# EAGLE schematic uoolight (EAGLE 6.5.0)
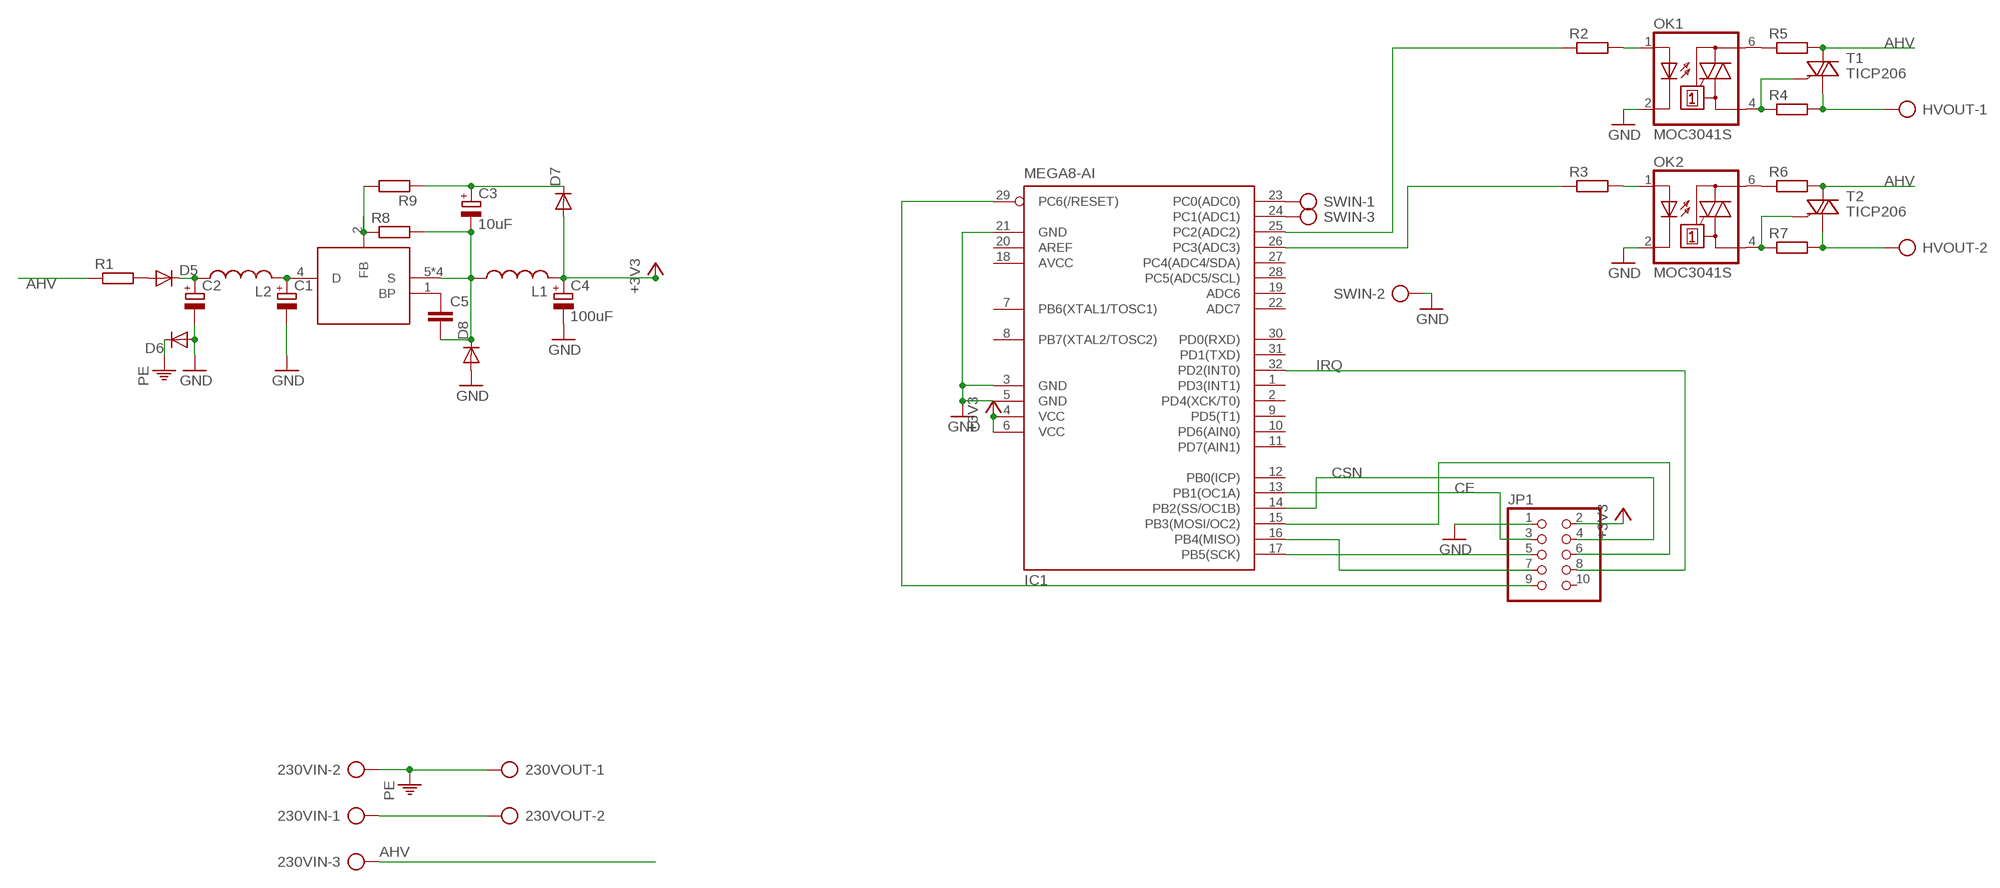
[diagram p0: schematic, sheet 1]

## Parts
230VIN  AK500/3  [AK500/3]
230VOUT  AK500/2  [AK500/2]
C1  CPOL-EUE5-10.5  [E5-10,5]
C2  CPOL-EUE5-10.5  [E5-10,5]
C3  10uF  CPOL-EU153CLV-0505  [153CLV-0505]
C4  100uF  CPOL-EU153CLV-0605  [153CLV-0605]
C5  C-EUC0603K  [C0603K]
D5  DIODE-SOD323-W  [SOD323-W]
D6  DIODE-SOD323-W  [SOD323-W]
D7  DIODE-SOD323-W  [SOD323-W]
D8  DIODE-SOD123  [SOD123]
HVOUT  AK500/2  [AK500/2]
IC1  MEGA8-AI  [TQFP32-08]
JP1  PINHD-2X5  [2X05]
L1  L-USPIS2816  [PIS2816]
L2  L-USPIS2816  [PIS2816]
OK1  MOC3041S  [DIL6-SMD]
OK2  MOC3041S  [DIL6-SMD]
R1  R-EU_0309/12  [0309/12]
R2  R-EU_R0805  [R0805]
R3  R-EU_R0805  [R0805]
R4  R-EU_R0805  [R0805]
R5  R-EU_R0805  [R0805]
R6  R-EU_R0805  [R0805]
R7  R-EU_R0805  [R0805]
R8  R-EU_R0805  [R0805]
R9  R-EU_R0805  [R0805]
SWIN  AK500/3  [AK500/3]
T1  TICP206  [TO92-6]
T2  TICP206  [TO92-6]
U$1  LNK304  [SO8(SO-8C)]

## Nets
+3V3: C4.+ D7.A IC1.4(VCC) IC1.6(VCC) JP1.2 L1.2
AHV: 230VIN.3 R1.1 R5.2 R6.2 T1.A2 T2.A2
CE: IC1.13(PB1(OC1A)) JP1.3
CSN: IC1.14(PB2(SS/OC1B)) JP1.4
GND: C1.- C2.- C4.- D6.A D8.A IC1.3(GND) IC1.5(GND) IC1.21(GND) JP1.1 OK1.2(C) OK2.2(C) SWIN.2
HVG: 230VIN.1 230VOUT.2
IRQ: IC1.32(PD2(INT0)) JP1.8
MISO: IC1.16(PB4(MISO)) JP1.7
MOSI: IC1.15(PB3(MOSI/OC2)) JP1.6
N$1: OK1.1(A) R2.2
N$3: D5.A R1.2
N$5: OK1.4(A1) R4.1 T1.G
N$6: HVOUT.1 R4.2 T1.A1
N$7: OK1.6(A2) R5.1
N$8: IC1.23(PC0(ADC0)) SWIN.1
N$9: OK2.6(A2) R6.1
N$10: IC1.24(PC1(ADC1)) SWIN.3
N$11: OK2.4(A1) R7.1 T2.G
N$12: IC1.29(PC6(/RESET)) JP1.9
N$13: IC1.25(PC2(ADC2)) R2.1
N$14: HVOUT.2 R7.2 T2.A1
N$15: IC1.26(PC3(ADC3)) R3.1
N$16: C3.- C5.2 D8.C L1.1 R8.2 U$1.5(S) U$1.6(S) U$1.7(S) U$1.8(S)
N$17: C1.+ L2.2 U$1.4(D)
N$18: R8.1 R9.2 U$1.2(FB)
N$19: C2.+ D5.C L2.1
N$21: C3.+ D7.C R9.1
N$22: C5.1 U$1.1(BP)
N$23: OK2.1(A) R3.2
PE: 230VIN.2 230VOUT.1 D6.C
SCK: IC1.17(PB5(SCK)) JP1.5
Unconnected: IC1.1(PD3(INT1)) IC1.2(PD4(XCK/T0)) IC1.7(PB6(XTAL1/TOSC1)) IC1.8(PB7(XTAL2/TOSC2)) IC1.9(PD5(T1)) IC1.10(PD6(AIN0)) IC1.11(PD7(AIN1)) IC1.12(PB0(ICP)) IC1.19(ADC6) IC1.20(AREF) IC1.22(ADC7) IC1.27(PC4(ADC4/SDA)) IC1.28(PC5(ADC5/SCL)) IC1.30(PD0(RXD)) IC1.31(PD1(TXD)) JP1.10

## Power pins joined to a net without a drawn wire
AVCC: IC1.18(AVCC)

## Library data of the parts
230VIN SWIN = con-ptr500:AK500/3: CONNECTOR; OC_FARNELL: unknown; OC_NEWARK: unknown
230VOUT HVOUT = con-ptr500:AK500/2: CONNECTOR; OC_FARNELL: unknown; OC_NEWARK: unknown
C1-C4 = rcl:CPOL-EU: POLARIZED CAPACITOR, European symbol
C5 = rcl:C-EU: CAPACITOR, European symbol
D5-D8 = diode:DIODE-: DIODE
IC1 = atmel:MEGA8: MICROCONTROLLER 8 Kbytes FLASH, 1 kbytes SRAM, 512 bytes EEPROM, USART, 6-channel 10 bit ADC, 2-channel 8 bit ADC Pin compatible with Atmega48, ATMega88, ATMega168 Source: avr.lbr; MPN: ATMEGA8-16AU; OC_FARNELL: 9171371; OC_NEWARK: 73M8863
JP1 = pinhead:PINHD-2X5: PIN HEADER
L1 L2 = rcl:L-US: INDUCTOR, American symbol
OK1 OK2 = optocoupler:MOC30*: 6-Pin DIP Zero-Cross Optoisolators Triac Driver Output (250/400 Volt Peak) Source: Data sheet <http://www.fairchildsemi.com/ds/MO/MOC3031M.pdf> The old path of data sheet not more available 2013-05-06.; MF: FAIRCHILD SEMICONDUCTOR; MPN: MOC3041S-M; OC_FARNELL: unknown; OC_NEWARK: 05C2885
R1-R9 = rcl:R-EU_: RESISTOR, European symbol
T1 T2 = triac:TICP206: TRIAC
U$1 = uoo:LNK304